# Altium schematic sheet A-02 PWR TREE.SchDoc
size 513 x 386 mm
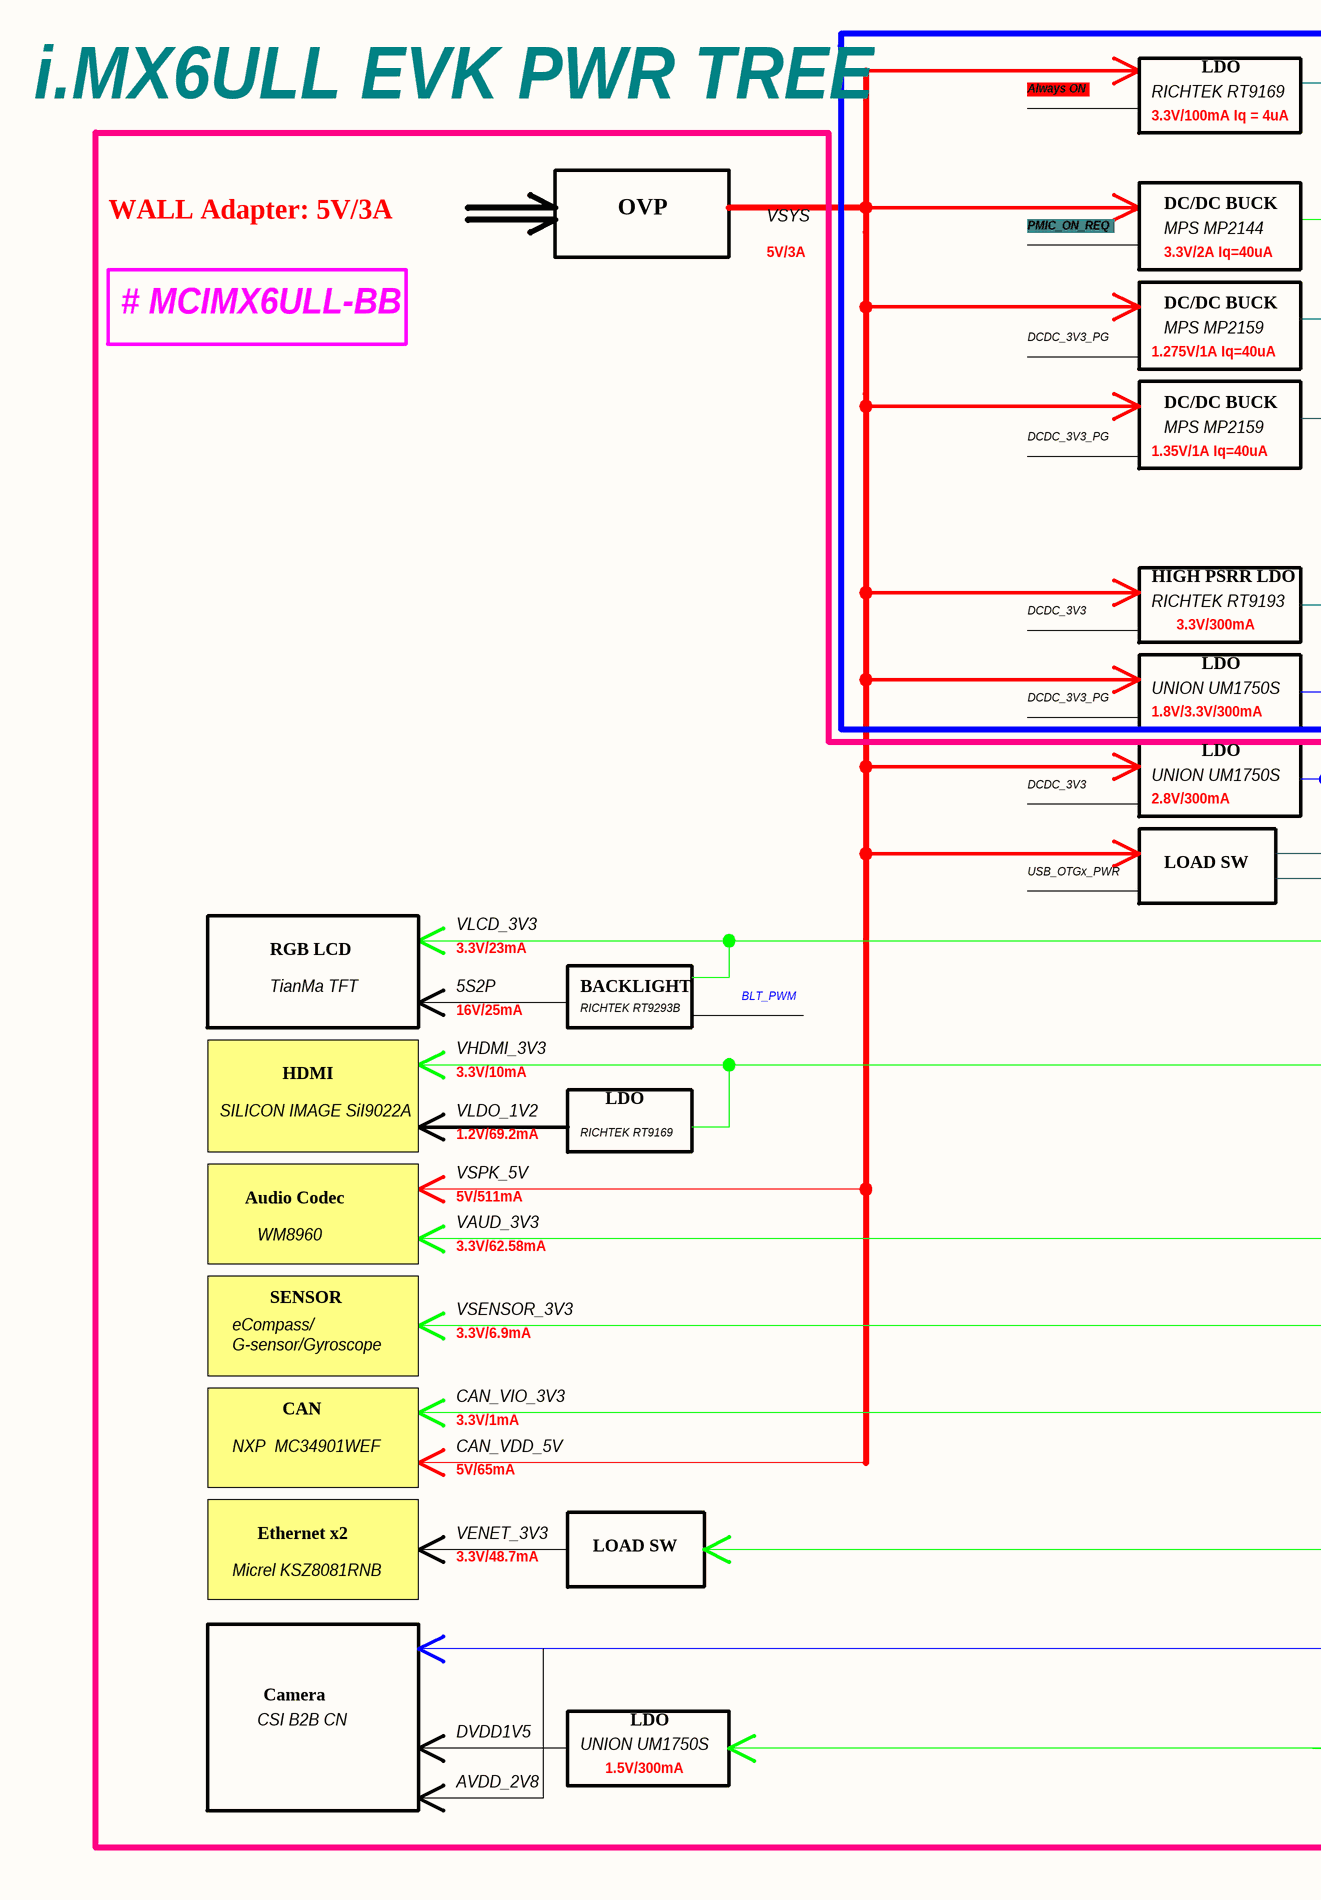
[diagram p0: A-02 PWR TREE.SchDoc, left]
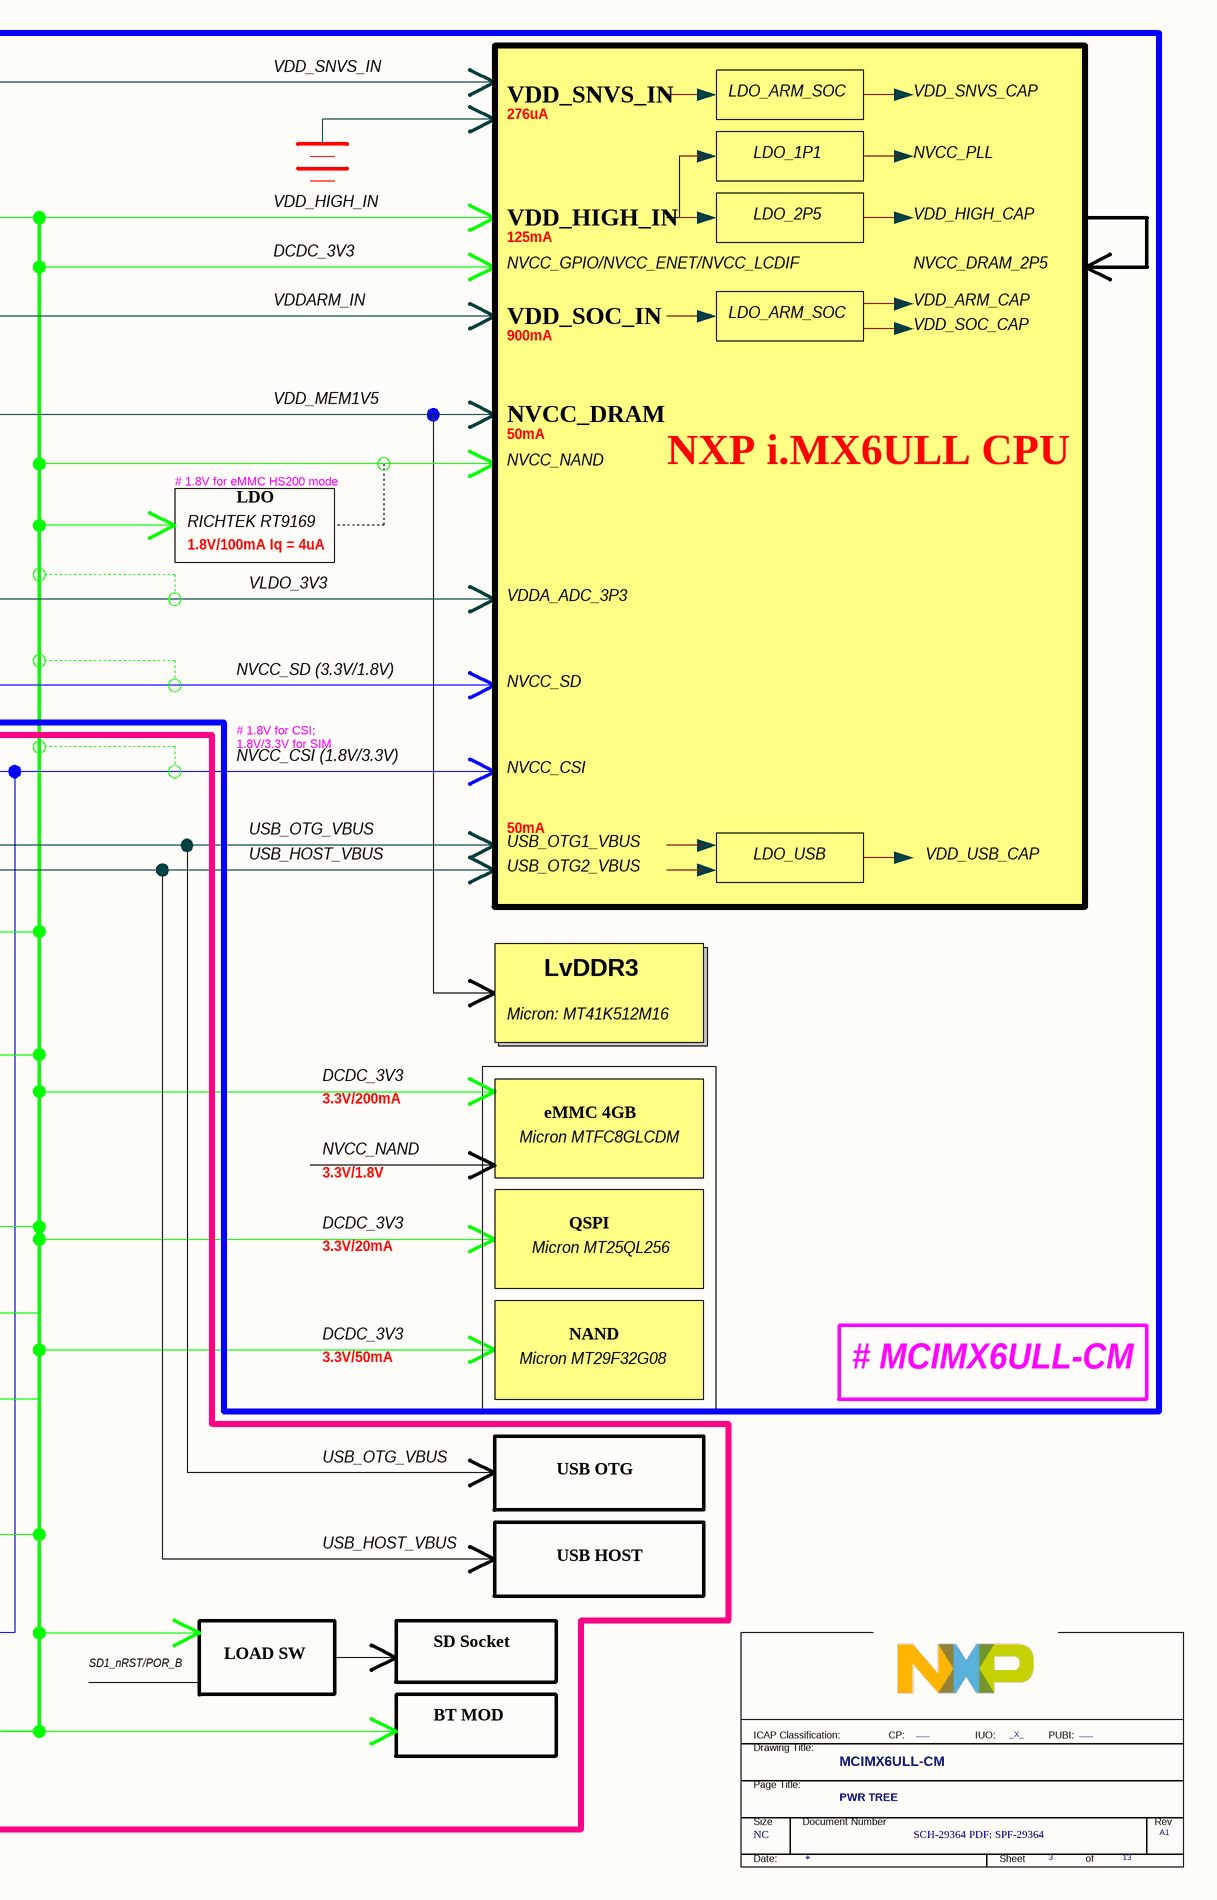
[diagram p1: A-02 PWR TREE.SchDoc, right]

## Parts
*  PageTitle: PWR TREE  Page Count: 13  Page Number: 3  Page Size: NC  Title: MCIMX6ULL-CM  RevCode: A1  Doc: SCH-29364 PDF: SPF-29364  FCP: ___  FIUO: _X_  (hidden comment: TitleBlock_FS)  (graphical)

## Notes on the sheet
- i.MX6ULL EVK PWR TREE
- Always ON
- RICHTEK RT9169
- 3.3V/100mA Iq = 4uA
- LDO
- VDD_SNVS_IN
- 276uA
- LDO_ARM_SOC
- VDD_SNVS_CAP
- LDO_1P1
- NVCC_PLL
- WALL Adapter: 5V/3A
- OVP
- VSYS
- PMIC_ON_REQ
- DC/DC BUCK
- MPS MP2144
- VDD_HIGH_IN
- 125mA
- LDO_2P5
- VDD_HIGH_CAP
- 5V/3A
- 3.3V/2A Iq=40uA
- DCDC_3V3
- NVCC_GPIO/NVCC_ENET/NVCC_LCDIF
- NVCC_DRAM_2P5
- # MCIMX6ULL-BB
- DCDC_3V3_PG
- 1.275V/1A Iq=40uA
- MPS MP2159
- VDDARM_IN
- 900mA
- VDD_SOC_IN
- VDD_ARM_CAP
- VDD_SOC_CAP
- VDD_MEM1V5
- NVCC_DRAM
- 1.35V/1A Iq=40uA
- # 1.8V for eMMC HS200 mode
- NVCC_NAND
- 50mA
- NXP i.MX6ULL CPU
- 1.8V/100mA Iq = 4uA
- RICHTEK RT9193
- HIGH PSRR LDO
- VLDO_3V3
- VDDA_ADC_3P3
- 3.3V/300mA
- UNION UM1750S
- 1.8V/3.3V/300mA
- # 1.8V for CSI;
  1.8V/3.3V for SIM
- NVCC_SD (3.3V/1.8V)
- NVCC_SD
- 2.8V/300mA
- NVCC_CSI (1.8V/3.3V)
- NVCC_CSI
- USB_OTG_VBUS
- USB_OTG1_VBUS
- USB_OTGx_PWR
- LOAD SW
- USB_HOST_VBUS
- USB_OTG2_VBUS
- LDO_USB
- VDD_USB_CAP
- RGB LCD
- VLCD_3V3
- 3.3V/23mA
- LvDDR3
- TianMa TFT
- 5S2P
- 16V/25mA
- RICHTEK RT9293B
- BACKLIGHT
- BLT_PWM
- Micron: MT41K512M16
- HDMI
- VHDMI_3V3
- 3.3V/10mA
- 3.3V/200mA
- SILICON IMAGE SiI9022A
- VLDO_1V2
- 1.2V/69.2mA
- Micron MTFC8GLCDM
- eMMC 4GB
- Audio Codec
- VSPK_5V
- VAUD_3V3
- 5V/511mA
- 3.3V/1.8V
- WM8960
- 3.3V/62.58mA
- 3.3V/20mA
- Micron MT25QL256
- QSPI
- eCompass/
  G-sensor/Gyroscope
- SENSOR
- 3.3V/6.9mA
- VSENSOR_3V3
- NAND
- CAN
- 3.3V/1mA
- CAN_VIO_3V3
- 3.3V/50mA
- Micron MT29F32G08
- # MCIMX6ULL-CM
- NXP  MC34901WEF
- 5V/65mA
- CAN_VDD_5V
- Ethernet x2
- VENET_3V3
- USB OTG
- Micrel KSZ8081RNB
- 3.3V/48.7mA
- USB HOST
- SD Socket
- CSI B2B CN
- Camera
- SD1_nRST/POR_B
- DVDD1V5
- AVDD_2V8
- 1.5V/300mA
- BT MOD
- (in symbol TitleBlock_FS) ICAP Classification:; CP:; IUO:; PUBI:; Drawing Title:; Page Title:; Size; Document Number; Rev; Date:; Sheet; of

## Library data of the parts
* = TitleBlock_FS: OrgAddr2: Austin, TX 78735-8598; OrgAddr1: 6501 William Cannon Drive West; OrgName: Freescale Semiconductor; Page Create Date: March  8, 1995; PUBI: ___; Page Modify Date: *